# EAGLE schematic nRF52832_MCU (EAGLE 8.3.0)
Contributed by Nordic Semiconductor Product Page here <http://infocenter.nordicsemi.com/index.jsp?topic=%2Fcom.nordic.infocenter.nrf52832.ps.v1.1%2Fref_circuitry.html> Disclaimer: For the most up to date reference layout see the infocenter at nordicsemi.com Description: Bluetooth Low Energy board

## Sheet 1 of 2
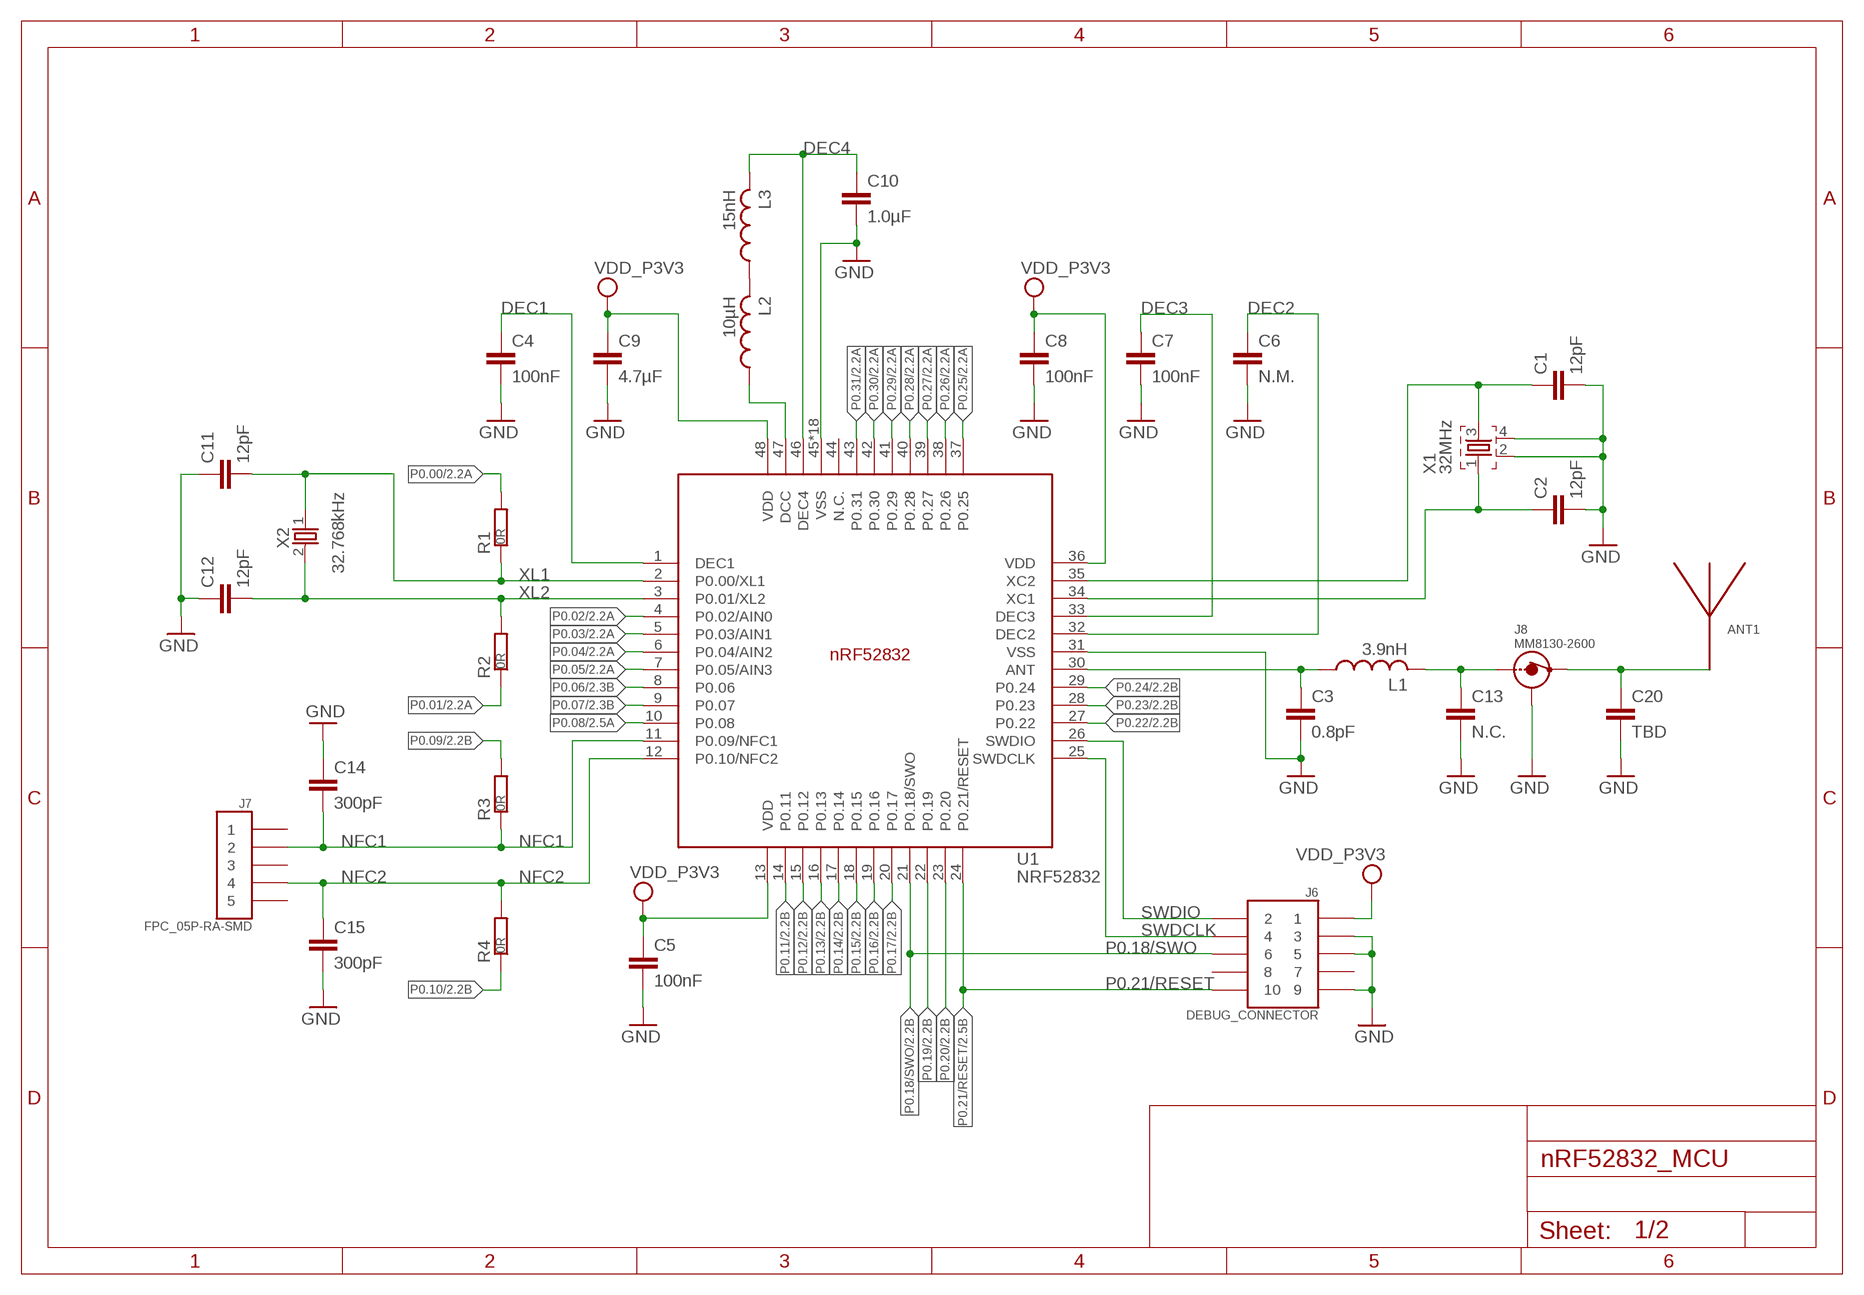
[diagram p0: schematic, sheet 1]

### Parts
ANT1  ANTENNA_QUARTER-WAVE_MONOPOLE_MEANDERED_LEFT  [QWMP_MEANDERED_LEFT_+6]
C1  12pF  CAPACITOR_0402_N  [RESC0402_N]
C2  12pF  CAPACITOR_0402_N  [RESC0402_N]
C3  0.8pF  CAPACITOR_0402_N  [RESC0402_N]
C4  100nF  CAPACITOR_0402_N  [RESC0402_N]
C5  100nF  CAPACITOR_0402_N  [RESC0402_N]
C6  N.M.  CAPACITOR_0402_N  [RESC0402_N]
C7  100nF  CAPACITOR_0402_N  [RESC0402_N]
C8  100nF  CAPACITOR_0402_N  [RESC0402_N]
C9  4.7µF  CAPACITOR_0603_N  [RESC0603_N]
C10  1.0µF  CAPACITOR_0603_N  [RESC0603_N]
C11  12pF  CAPACITOR_0402_N  [RESC0402_N]
C12  12pF  CAPACITOR_0402_N  [RESC0402_N]
C13  N.C.  CAPACITOR_0402_N  [RESC0402_N]
C14  300pF  CAPACITOR_0402_N  [RESC0402_N]
C15  300pF  CAPACITOR_0402_N  [RESC0402_N]
C20  TBD  CAPACITOR_0402_N  [RESC0402_N]
J6  DEBUG_CONNECTOR  [HDRV127P5X2-10_N]
J7  FPC_05P-RA-SMD  [FPC_05P-RA-SMD]
J8  MM8130-2600  [MM8130-2600]
L1  3.9nH  INDUCTOR_0402_N  [RESC0402_N]
L2  10µH  INDUCTOR_0603_N  [RESC0603_N]
L3  15nH  INDUCTOR_0402_N  [RESC0402_N]
R1  0R  RESISTOR_0402_N  [RESC0402_N]
R2  0R  RESISTOR_0402_N  [RESC0402_N]
R3  0R  RESISTOR_0402_N  [RESC0402_N]
R4  0R  RESISTOR_0402_N  [RESC0402_N]
U1  NRF52832  [QFN40P600X600X90-48_N]
X1  32MHz  XTAL_32MHZ  [BT-XTAL_2016_N]
X2  32.768kHz  XTAL_32KHZ  [XTAL_3215_N]

### Nets
ANT: C3.1 L1.1 U1.30(ANT)
DEC1: C4.1 U1.1(DEC1)
DEC2: C6.1 U1.32(DEC2)
DEC3: C7.1 U1.33(DEC3)
DEC4: C10.1 L3.2 U1.46(DEC4)
GND: C1.2 C2.2 C3.2 C4.2 C5.2 C6.2 C7.2 C8.2 C9.2 C10.2 C11.1 C12.1 C13.2 C14.1 C15.2 C20.2 J6.3 J6.5 J6.9 J8.1 J8.2 J8.3 J8.4 U1.31(VSS) U1.45(VSS) U1.PAD(VSS) U1.PAD@VIA01(VSS) U1.PAD@VIA02(VSS) U1.PAD@VIA03(VSS) U1.PAD@VIA04(VSS) U1.PAD@VIA05(VSS) U1.PAD@VIA06(VSS) U1.PAD@VIA07(VSS) U1.PAD@VIA08(VSS) U1.PAD@VIA09(VSS) U1.PAD@VIA10(VSS) U1.PAD@VIA11(VSS) U1.PAD@VIA12(VSS) U1.PAD@VIA13(VSS) U1.PAD@VIA14(VSS) U1.PAD@VIA15(VSS) U1.PAD@VIA16(VSS) X1.2 X1.4 ; also sheet 2
N$1: ANT1.P$1 C20.1 J8.OUT
N$2: L2.2 L3.1
N$3: C1.1 U1.35(XC2) X1.3
N$4: L2.1 U1.47(DCC)
N$5: C13.1 J8.IN L1.2
NFC1: C14.2 J7.2 R3.1 U1.11(P0.09/NFC1)
NFC2: C15.1 J7.4 R4.2 U1.12(P0.10/NFC2)
P0.00: R1.2 ; also sheet 2
P0.01: R2.1 ; also sheet 2
P0.02: U1.4(P0.02/AIN0) ; also sheet 2
P0.03: U1.5(P0.03/AIN1) ; also sheet 2
P0.04: U1.6(P0.04/AIN2) ; also sheet 2
P0.05: U1.7(P0.05/AIN3) ; also sheet 2
P0.06: U1.8(P0.06) ; also sheet 2
P0.07: U1.9(P0.07) ; also sheet 2
P0.08: U1.10(P0.08) ; also sheet 2
P0.09: R3.2 ; also sheet 2
P0.10: R4.1 ; also sheet 2
P0.11: U1.14(P0.11) ; also sheet 2
P0.12: U1.15(P0.12) ; also sheet 2
P0.13: U1.16(P0.13) ; also sheet 2
P0.14: U1.17(P0.14) ; also sheet 2
P0.15: U1.18(P0.15) ; also sheet 2
P0.16: U1.19(P0.16) ; also sheet 2
P0.17: U1.20(P0.17) ; also sheet 2
P0.18/SWO: J6.6 U1.21(P0.18/SWO) ; also sheet 2
P0.19: U1.22(P0.19) ; also sheet 2
P0.20: U1.23(P0.20) ; also sheet 2
P0.21/RESET: J6.10 U1.24(P0.21/RESET) ; also sheet 2
P0.22: U1.27(P0.22) ; also sheet 2
P0.23: U1.28(P0.23) ; also sheet 2
P0.24: U1.29(P0.24) ; also sheet 2
P0.25: U1.37(P0.25) ; also sheet 2
P0.26: U1.38(P0.26) ; also sheet 2
P0.27: U1.39(P0.27) ; also sheet 2
P0.28: U1.40(P0.28) ; also sheet 2
P0.29: U1.41(P0.29) ; also sheet 2
P0.30: U1.42(P0.30) ; also sheet 2
P0.31: U1.43(P0.31) ; also sheet 2
SWDCLK: J6.4 U1.25(SWDCLK)
SWDIO: J6.2 U1.26(SWDIO)
VDD_P3V3: C5.1 C8.1 C9.1 J6.1 U1.13(VDD) U1.36(VDD) U1.48(VDD) ; also sheet 2
X1: C2.1 U1.34(XC1) X1.1
XL1: C11.2 R1.1 U1.2(P0.00/XL1) X2.1
XL2: C12.2 R2.2 U1.3(P0.01/XL2) X2.2
Unconnected: J6.7 J6.8 J7.1 J7.3 J7.5 U1.44(N.C.)

## Sheet 2 of 2
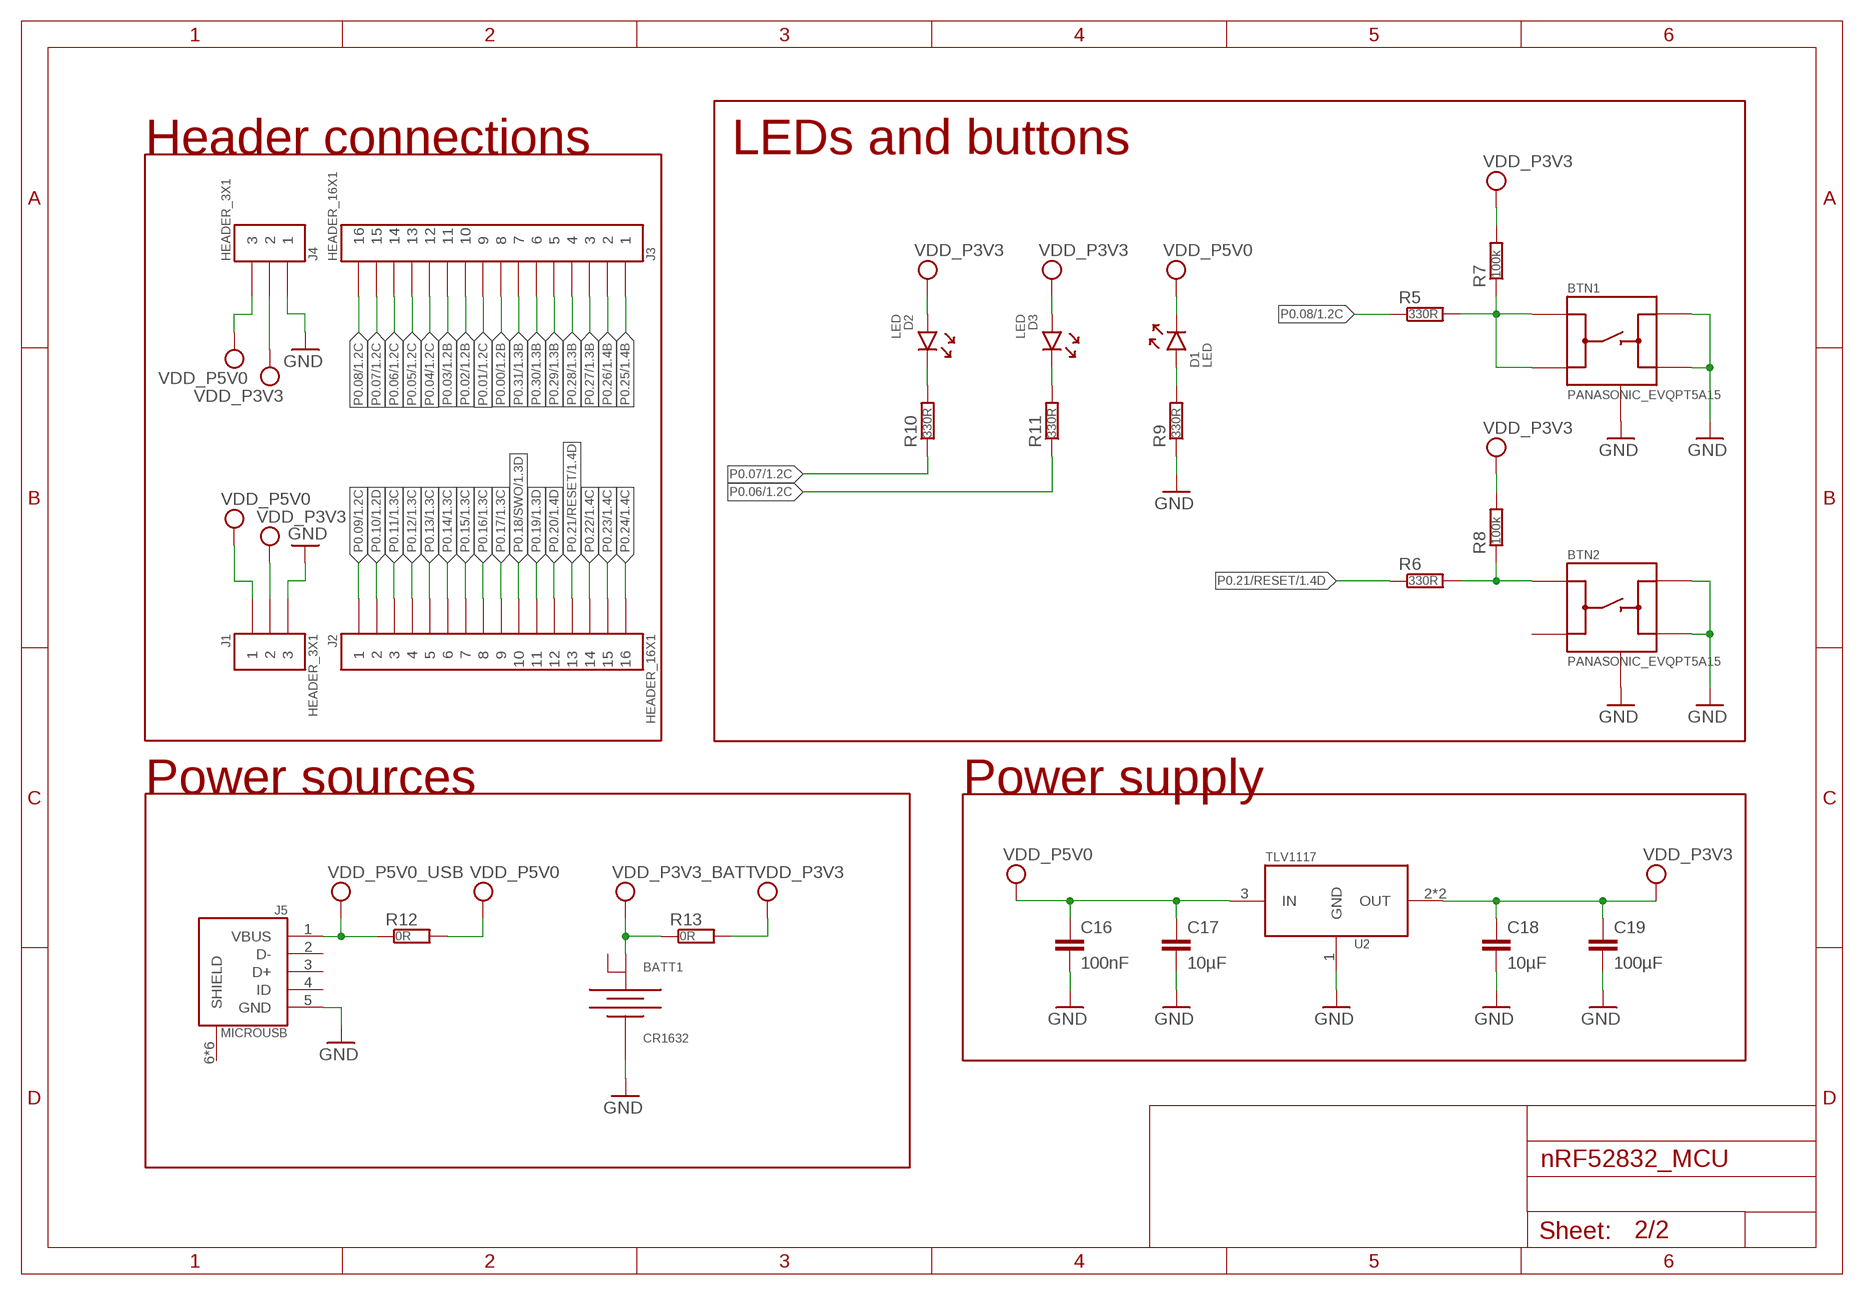
[diagram p1: schematic, sheet 2]

### Parts
BATT1  CR1632  [CR1632_HOLDER_TH]
BTN1  PANASONIC_EVQPT5A15  [PANASONIC_EVQPT5A15]
BTN2  PANASONIC_EVQPT5A15  [PANASONIC_EVQPT5A15]
C16  100nF  CAPACITOR_0402_N  [RESC0402_N]
C17  10µF  CAPACITOR_0603_N  [RESC0603_N]
C18  10µF  CAPACITOR_0603_N  [RESC0603_N]
C19  100µF  CAPACITOR_0805_N  [RESC0805_N]
D1  LED  [DIOC0603_N]
D2  LED  [DIOC0603_N]
D3  LED  [DIOC0603_N]
J1  HEADER_3X1  [HDRV3W64P254_1X3_762X254X900B_NO_SILK]
J2  HEADER_16X1  [HDRV16W64P254_1X16_4064X254X900B_NO_SILK]
J3  HEADER_16X1  [HDRV16W64P254_1X16_4064X254X900B_NO_SILK]
J4  HEADER_3X1  [HDRV3W64P254_1X3_762X254X900B_NO_SILK]
J5  MICROUSB  [USB-MICRO-B-RA-SMD-PIP]
R5  330R  RESISTOR_0402_N  [RESC0402_N]
R6  330R  RESISTOR_0402_N  [RESC0402_N]
R7  100k  RESISTOR_0402_N  [RESC0402_N]
R8  100k  RESISTOR_0402_N  [RESC0402_N]
R9  330R  RESISTOR_0402_N  [RESC0402_N]
R10  330R  RESISTOR_0402_N  [RESC0402_N]
R11  330R  RESISTOR_0402_N  [RESC0402_N]
R12  0R  RESISTOR_0402_N  [RESC0402_N]
R13  0R  RESISTOR_0402_N  [RESC0402_N]
U2  TLV1117  [SOT220P700-4_N]

### Nets
GND: BATT1.1(-) BTN1.3(B) BTN1.4(B') BTN1.5(GND) BTN1.6(GND) BTN2.3(B) BTN2.4(B') BTN2.5(GND) BTN2.6(GND) C16.2 C17.2 C18.2 C19.2 J1.P$3 J4.P$1 J5.5(GND) R9.1 U2.1(GND) ; also sheet 1
N$6: BTN2.1(A) R6.2 R8.1
N$7: BTN1.1(A) BTN1.2(A') R5.2 R7.1
N$8: D2.1(C) R10.2
N$9: D3.1(C) R11.2
P0.00: J3.P$8 ; also sheet 1
P0.01: J3.P$9 ; also sheet 1
P0.02: J3.P$10 ; also sheet 1
P0.03: J3.P$11 ; also sheet 1
P0.04: J3.P$12 ; also sheet 1
P0.05: J3.P$13 ; also sheet 1
P0.06: J3.P$14 R11.1 ; also sheet 1
P0.07: J3.P$15 R10.1 ; also sheet 1
P0.08: J3.P$16 R5.1 ; also sheet 1
P0.09: J2.P$1 ; also sheet 1
P0.10: J2.P$2 ; also sheet 1
P0.11: J2.P$3 ; also sheet 1
P0.12: J2.P$4 ; also sheet 1
P0.13: J2.P$5 ; also sheet 1
P0.14: J2.P$6 ; also sheet 1
P0.15: J2.P$7 ; also sheet 1
P0.16: J2.P$8 ; also sheet 1
P0.17: J2.P$9 ; also sheet 1
P0.18/SWO: J2.P$10 ; also sheet 1
P0.19: J2.P$11 ; also sheet 1
P0.20: J2.P$12 ; also sheet 1
P0.21/RESET: J2.P$13 R6.1 ; also sheet 1
P0.22: J2.P$14 ; also sheet 1
P0.23: J2.P$15 ; also sheet 1
P0.24: J2.P$16 ; also sheet 1
P0.25: J3.P$1 ; also sheet 1
P0.26: J3.P$2 ; also sheet 1
P0.27: J3.P$3 ; also sheet 1
P0.28: J3.P$4 ; also sheet 1
P0.29: J3.P$5 ; also sheet 1
P0.30: J3.P$6 ; also sheet 1
P0.31: J3.P$7 ; also sheet 1
VCC_P5V0_USB: J5.1(VBUS) R12.1 ; supply symbol labelled VDD_P5V0_USB
VDD_LED: D1.2(A) R9.2
VDD_P3V3: C18.1 C19.1 D2.2(A) D3.2(A) J1.P$2 J4.P$2 R7.2 R8.2 R13.2 U2.2(OUT) U2.4(OUT) ; also sheet 1
VDD_P3V3_BATT: BATT1.2(+) R13.1
VDD_P5V0: C16.1 C17.1 D1.1(C) J1.P$1 J4.P$3 R12.2 U2.3(IN)
Unconnected: BATT1.3(+2) BTN2.2(A') J5.2(D-) J5.3(D+) J5.4(ID) J5.6(SHIELD) J5.7(SHIELD) J5.8(SHIELD) J5.9(SHIELD) J5.10(SHIELD) J5.11(SHIELD)

### Notes on the sheet
- Header connections | LEDs and buttons
- Power sources | Power supply

## Library data of the parts
ANT1 = Nordic_misc:ANTENNA_QUARTER-WAVE_MONOPOLE_MEANDERED_LEFT
BATT1 = Nordic_misc:CR1632: KEYSTONE 3013 BATTERY THM RETAINER, 16MM Farnell: 1650698
BTN1 BTN2 = Nordic_misc:PANASONIC_EVQPT5A15
C1-C20 = Nordic_misc:CAPACITOR: Generic chip capacitor
D1-D3 = Nordic_misc:LED
J1 J4 = Nordic_misc:HEADER_3X1
J2 J3 = Nordic_misc:HEADER_16X1
J5 = Nordic_misc:MICROUSB
J6 = Nordic_misc:DEBUG_CONNECTOR
J7 = Nordic_misc:FPC_05P-RA-SMD
J8 = Nordic_misc:MM8130-2600
L1-L3 = Nordic_misc:INDUCTOR: Generic chip inductor
R1-R13 = Nordic_misc:RESISTOR: Generic chip resistor
U1 = Nordic_nRF:NRF52832: nRF52832 Features Single chip, highly flexible, 2.4 GHz multi-protocol SoC 32-bit ARM Cortex-M4F Processor 1.7v to 3.6v operation 512kB flash + 64kB RAM Supports concurrent Bluetooth Smart/ANT protocol operation On-chip NFC tag for Out-of-Band (OOB) pairing Up to +4dBm output power -96dBm sensitivity, Bluetooth Smart Thread safe and run-time protected Event driven API On air compatible with nRF24L and nRF24AP series 2 data rates (2Mbps/1Mbps) PPI - maximum flexibility for power-efficient applications and code simplification Automated power management system with automatic power management of each peripheral Configurable I/O mapping for analog and digital I/O 3 x Master/Slave SPI 2 x Two-wire interface (I²C) UART (RTS/CTS) 3 x PWM AES HW encryption Real Time Counter (RTC) Digital microphone interface (PDM) On-chip balun Applications Internet of Things (IoT) Wearables SmartHome sensors Connected white goods Computer peripherals Voice-command smart remotes A4WP ‘Rezence’ wireless charging Beacons Sports and fitness sensors and hubs Connected health products Smart watches RC Toys Interactive games Building automation and sensor networks
U2 = Nordic_misc:TLV1117
X1 = Nordic_nRF:XTAL_32MHZ
X2 = Nordic_nRF:XTAL_32KHZ